# Altium schematic sheet CSI.SchDoc
size A3
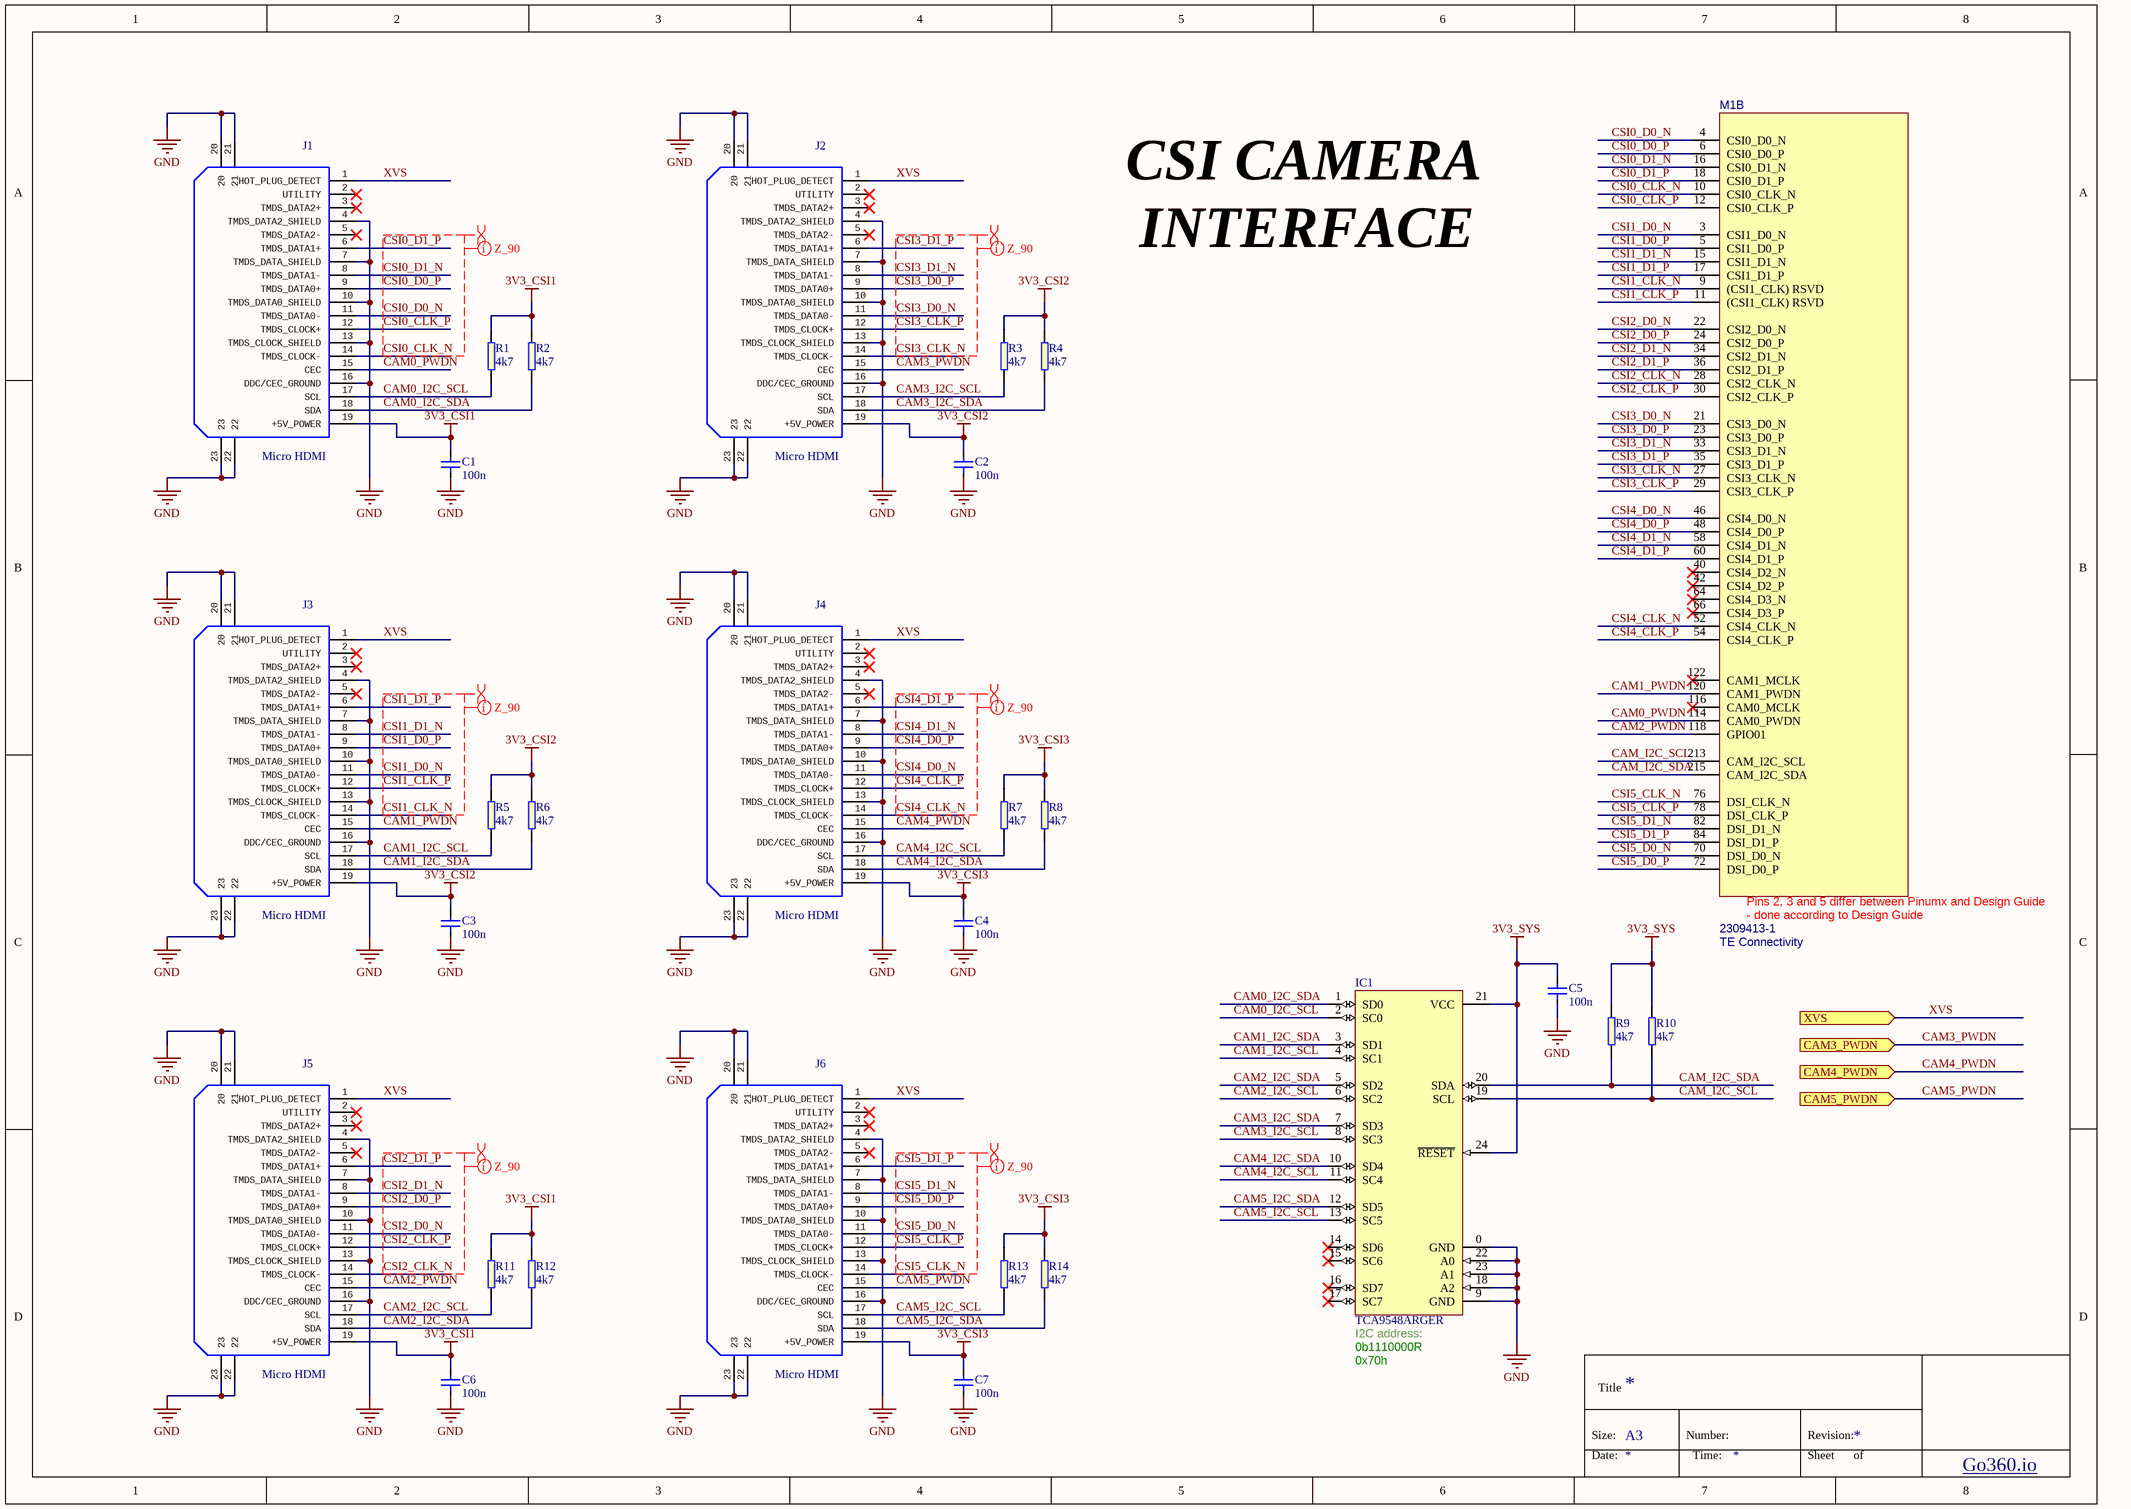
[diagram p0: CSI.SchDoc]

## Parts
C1  100n  [C0402]
C2  100n  [C0402]
C3  100n  [C0402]
C4  100n  [C0402]
C5  100n  [C0402]
C6  100n  [C0402]
C7  100n  [C0402]
IC1  TCA9548ARGER  [VQFN-24]
J1  Micro HDMI  [HDMI-0467650301]
J2  Micro HDMI  [HDMI-0467650301]
J3  Micro HDMI  [HDMI-0467650301]
J4  Micro HDMI  [HDMI-0467650301]
J5  Micro HDMI  [HDMI-0467650301]
J6  Micro HDMI  [HDMI-0467650301]
M1  Manufacturer: TE Connectivity  [jetson-nano-connector]  (hidden comment: 2309413-1)  (part B of 7)
R1  4k7  [R0402]
R2  4k7  [R0402]
R3  4k7  [R0402]
R4  4k7  [R0402]
R5  4k7  [R0402]
R6  4k7  [R0402]
R7  4k7  [R0402]
R8  4k7  [R0402]
R9  4k7  [R0402]
R10  4k7  [R0402]
R11  4k7  [R0402]
R12  4k7  [R0402]
R13  4k7  [R0402]
R14  4k7  [R0402]

## Ports
CAM3_PWDN (in), CAM4_PWDN (in), CAM5_PWDN (in), XVS (in)

## Nets
3V3_CSI1: C1.2 C6.2 J1.19(+5V_POWER) J5.19(+5V_POWER) R1.2 R2.2 R11.2 R12.2
3V3_CSI2: C2.2 C3.2 J2.19(+5V_POWER) J3.19(+5V_POWER) R3.2 R4.2 R5.2 R6.2
3V3_CSI3: C4.2 C7.2 J4.19(+5V_POWER) J6.19(+5V_POWER) R7.2 R8.2 R13.2 R14.2
3V3_SYS: C5.2 IC1.21(VCC) IC1.24(~{RESET}) R9.2 R10.2
GND: C1.1 C2.1 C3.1 C4.1 C5.1 C6.1 C7.1 IC1.0(GND) IC1.9(GND) IC1.18(A2) IC1.22(A0) IC1.23(A1) J1.4(TMDS_DATA2_SHIELD) J1.7(TMDS_DATA_SHIELD) J1.10(TMDS_DATA0_SHIELD) J1.13(TMDS_CLOCK_SHIELD) J1.16(DDC/CEC_GROUND) J1.20 J1.21 J1.22 J1.23 J2.4(TMDS_DATA2_SHIELD) J2.7(TMDS_DATA_SHIELD) J2.10(TMDS_DATA0_SHIELD) J2.13(TMDS_CLOCK_SHIELD) J2.16(DDC/CEC_GROUND) J2.20 J2.21 J2.22 J2.23 J3.4(TMDS_DATA2_SHIELD) J3.7(TMDS_DATA_SHIELD) J3.10(TMDS_DATA0_SHIELD) J3.13(TMDS_CLOCK_SHIELD) J3.16(DDC/CEC_GROUND) J3.20 J3.21 J3.22 J3.23 J4.4(TMDS_DATA2_SHIELD) J4.7(TMDS_DATA_SHIELD) J4.10(TMDS_DATA0_SHIELD) J4.13(TMDS_CLOCK_SHIELD) J4.16(DDC/CEC_GROUND) J4.20 J4.21 J4.22 J4.23 J5.4(TMDS_DATA2_SHIELD) J5.7(TMDS_DATA_SHIELD) J5.10(TMDS_DATA0_SHIELD) J5.13(TMDS_CLOCK_SHIELD) J5.16(DDC/CEC_GROUND) J5.20 J5.21 J5.22 J5.23 J6.4(TMDS_DATA2_SHIELD) J6.7(TMDS_DATA_SHIELD) J6.10(TMDS_DATA0_SHIELD) J6.13(TMDS_CLOCK_SHIELD) J6.16(DDC/CEC_GROUND) J6.20 J6.21 J6.22 J6.23
CAM0_I2C_SCL: IC1.2(SC0) J1.17(SCL) R1.1
CAM0_I2C_SDA: IC1.1(SD0) J1.18(SDA) R2.1
CAM0_PWDN: J1.15(CEC) M1.114(CAM0_PWDN)
CAM1_I2C_SCL: IC1.4(SC1) J3.17(SCL) R5.1
CAM1_I2C_SDA: IC1.3(SD1) J3.18(SDA) R6.1
CAM1_PWDN: J3.15(CEC) M1.120(CAM1_PWDN)
CAM2_I2C_SCL: IC1.6(SC2) J5.17(SCL) R11.1
CAM2_I2C_SDA: IC1.5(SD2) J5.18(SDA) R12.1
CAM2_PWDN: J5.15(CEC) M1.118(GPIO01)
CAM3_I2C_SCL: IC1.8(SC3) J2.17(SCL) R3.1
CAM3_I2C_SDA: IC1.7(SD3) J2.18(SDA) R4.1
CAM3_PWDN: J2.15(CEC) ; port CAM3_PWDN
CAM4_I2C_SCL: IC1.11(SC4) J4.17(SCL) R7.1
CAM4_I2C_SDA: IC1.10(SD4) J4.18(SDA) R8.1
CAM4_PWDN: J4.15(CEC) ; port CAM4_PWDN
CAM5_I2C_SCL: IC1.13(SC5) J6.17(SCL) R13.1
CAM5_I2C_SDA: IC1.12(SD5) J6.18(SDA) R14.1
CAM5_PWDN: J6.15(CEC) ; port CAM5_PWDN
CAM_I2C_SCL: IC1.19(SCL) M1.213(CAM_I2C_SCL) R10.1
CAM_I2C_SDA: IC1.20(SDA) M1.215(CAM_I2C_SDA) R9.1
CSI0_CLK_N: J1.14(TMDS_CLOCK-) M1.10(CSI0_CLK_N)
CSI0_CLK_P: J1.12(TMDS_CLOCK+) M1.12(CSI0_CLK_P)
CSI0_D0_N: J1.11(TMDS_DATA0-) M1.4(CSI0_D0_N)
CSI0_D0_P: J1.9(TMDS_DATA0+) M1.6(CSI0_D0_P)
CSI0_D1_N: J1.8(TMDS_DATA1-) M1.16(CSI0_D1_N)
CSI0_D1_P: J1.6(TMDS_DATA1+) M1.18(CSI0_D1_P)
CSI1_CLK_N: J3.14(TMDS_CLOCK-) M1.9((CSI1_CLK)_RSVD)
CSI1_CLK_P: J3.12(TMDS_CLOCK+) M1.11((CSI1_CLK)_RSVD)
CSI1_D0_N: J3.11(TMDS_DATA0-) M1.3(CSI1_D0_N)
CSI1_D0_P: J3.9(TMDS_DATA0+) M1.5(CSI1_D0_P)
CSI1_D1_N: J3.8(TMDS_DATA1-) M1.15(CSI1_D1_N)
CSI1_D1_P: J3.6(TMDS_DATA1+) M1.17(CSI1_D1_P)
CSI2_CLK_N: J5.14(TMDS_CLOCK-) M1.28(CSI2_CLK_N)
CSI2_CLK_P: J5.12(TMDS_CLOCK+) M1.30(CSI2_CLK_P)
CSI2_D0_N: J5.11(TMDS_DATA0-) M1.22(CSI2_D0_N)
CSI2_D0_P: J5.9(TMDS_DATA0+) M1.24(CSI2_D0_P)
CSI2_D1_N: J5.8(TMDS_DATA1-) M1.34(CSI2_D1_N)
CSI2_D1_P: J5.6(TMDS_DATA1+) M1.36(CSI2_D1_P)
CSI3_CLK_N: J2.14(TMDS_CLOCK-) M1.27(CSI3_CLK_N)
CSI3_CLK_P: J2.12(TMDS_CLOCK+) M1.29(CSI3_CLK_P)
CSI3_D0_N: J2.11(TMDS_DATA0-) M1.21(CSI3_D0_N)
CSI3_D0_P: J2.9(TMDS_DATA0+) M1.23(CSI3_D0_P)
CSI3_D1_N: J2.8(TMDS_DATA1-) M1.33(CSI3_D1_N)
CSI3_D1_P: J2.6(TMDS_DATA1+) M1.35(CSI3_D1_P)
CSI4_CLK_N: J4.14(TMDS_CLOCK-) M1.52(CSI4_CLK_N)
CSI4_CLK_P: J4.12(TMDS_CLOCK+) M1.54(CSI4_CLK_P)
CSI4_D0_N: J4.11(TMDS_DATA0-) M1.46(CSI4_D0_N)
CSI4_D0_P: J4.9(TMDS_DATA0+) M1.48(CSI4_D0_P)
CSI4_D1_N: J4.8(TMDS_DATA1-) M1.58(CSI4_D1_N)
CSI4_D1_P: J4.6(TMDS_DATA1+) M1.60(CSI4_D1_P)
CSI5_CLK_N: J6.14(TMDS_CLOCK-) M1.76(DSI_CLK_N)
CSI5_CLK_P: J6.12(TMDS_CLOCK+) M1.78(DSI_CLK_P)
CSI5_D0_N: J6.11(TMDS_DATA0-) M1.70(DSI_D0_N)
CSI5_D0_P: J6.9(TMDS_DATA0+) M1.72(DSI_D0_P)
CSI5_D1_N: J6.8(TMDS_DATA1-) M1.82(DSI_D1_N)
CSI5_D1_P: J6.6(TMDS_DATA1+) M1.84(DSI_D1_P)
XVS: J1.1(HOT_PLUG_DETECT) J2.1(HOT_PLUG_DETECT) J3.1(HOT_PLUG_DETECT) J4.1(HOT_PLUG_DETECT) J5.1(HOT_PLUG_DETECT) J6.1(HOT_PLUG_DETECT) ; port XVS

Not connected (* = marked no-connect by the designer): IC1 14(SD6)* 15(SC6)* 16(SD7)* 17(SC7)*; J1 2(UTILITY)* 3(TMDS_DATA2+)* 5(TMDS_DATA2-)*; J2 2(UTILITY)* 3(TMDS_DATA2+)* 5(TMDS_DATA2-)*; J3 2(UTILITY)* 3(TMDS_DATA2+)* 5(TMDS_DATA2-)*; J4 2(UTILITY)* 3(TMDS_DATA2+)* 5(TMDS_DATA2-)*; J5 2(UTILITY)* 3(TMDS_DATA2+)* 5(TMDS_DATA2-)*; J6 2(UTILITY)* 3(TMDS_DATA2+)* 5(TMDS_DATA2-)*; M1 40(CSI4_D2_N)* 42(CSI4_D2_P)* 64(CSI4_D3_N)* 66(CSI4_D3_P)* 116(CAM0_MCLK)* 122(CAM1_MCLK)*

## Layout directives
differential pair: CSI0_CLK_N, CSI0_CLK_P, CSI0_D0_N, CSI0_D0_P, CSI0_D1_N, CSI0_D1_P, CSI1_CLK_N, CSI1_CLK_P, CSI1_D0_N, CSI1_D0_P, CSI1_D1_N, CSI1_D1_P, CSI2_CLK_N, CSI2_CLK_P, CSI2_D0_N, CSI2_D0_P, CSI2_D1_N, CSI2_D1_P, CSI3_CLK_N, CSI3_CLK_P, CSI3_D0_N, CSI3_D0_P, CSI3_D1_N, CSI3_D1_P, CSI4_CLK_N, CSI4_CLK_P, CSI4_D0_N, CSI4_D0_P, CSI4_D1_N, CSI4_D1_P, CSI5_CLK_N, CSI5_CLK_P, CSI5_D0_N, CSI5_D0_P, CSI5_D1_N, CSI5_D1_P
net class Z_95: CSI0_CLK_N, CSI0_CLK_P, CSI0_D0_N, CSI0_D0_P, CSI0_D1_N, CSI0_D1_P, CSI1_CLK_N, CSI1_CLK_P, CSI1_D0_N, CSI1_D0_P, CSI1_D1_N, CSI1_D1_P, CSI2_CLK_N, CSI2_CLK_P, CSI2_D0_N, CSI2_D0_P, CSI2_D1_N, CSI2_D1_P, CSI3_CLK_N, CSI3_CLK_P, CSI3_D0_N, CSI3_D0_P, CSI3_D1_N, CSI3_D1_P, CSI4_CLK_N, CSI4_CLK_P, CSI4_D0_N, CSI4_D0_P, CSI4_D1_N, CSI4_D1_P, CSI5_CLK_N, CSI5_CLK_P, CSI5_D0_N, CSI5_D0_P, CSI5_D1_N, CSI5_D1_P

## Notes on the sheet
- CSI CAMERA
- INTERFACE
- 0x70h
- (near IC1) 0b1110000R
- (near IC1) I2C address:
- Title
- Size:
- Date:
- A3
- Number:
- Time:
- Revision:
- Sheet
- of
- Go360.io
- (in symbol jetson-nano-new-release, part B) Pins 2, 3 and 5 differ between Pinumx and Design Guide; - done according to Design Guide

## Library data of the parts
C1-C7 = C_100n_0402: MLCC SMT Capacitor 100n 0402; Manufacturer: TDK; PartSymbol: C1005X5R0J104K050BA; PartNumber: C_100n_0402; Value: 100n
IC1 = TCA9548A: TCA9548ARGER  I2C SWITCH W/ RESET, 8-CH, VQFN-24; Manufacturer: TEXAS INSTRUMENTS; Value: TCA9548ARGER; PartNumber: TCA9548ARGER; PartSymbol: TCA9548ARGER
J1-J6 = HDMI-0467650301
M1 = jetson-nano-new-release: PartNumber: 2309413-1; PartSymbol: 2309413-1; Value: 2309413-1
R1-R14 = R_4k7_0402: RES, 4k7, 0402; Manufacturer: Panasonic; PartSymbol: ERJ2GEJ472X; PartNumber: R_4k7_0402; Value: 4k7